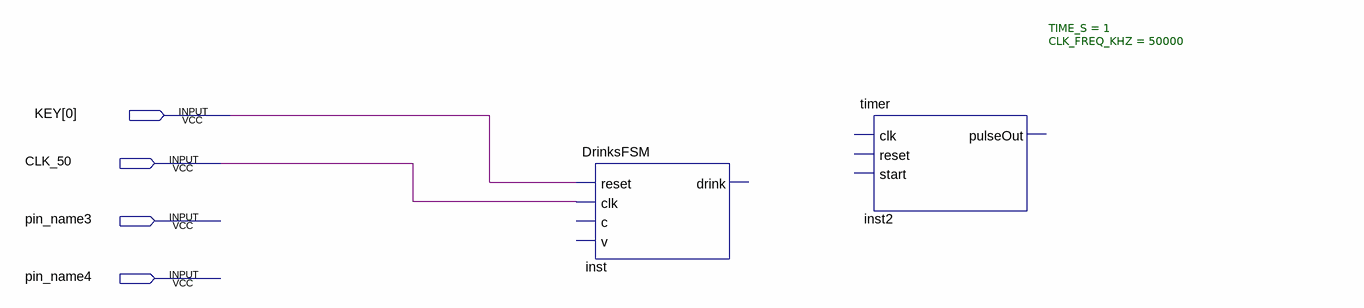
[diagram p0: schematic sheet]
// Quartus schematic Drinks.bdf as structural Verilog: 2 symbols, 4 pins
module Drinks (
  input  [0:0] KEY,
  input  CLK_50,
  input  pin_name3,
  input  pin_name4
);

  DrinksFSM inst (.reset(KEY[0]), .clk(CLK_50));  // open: c, v, drink
  timer #(.TIME_S(1), .CLK_FREQ_KHZ(50000)) inst2 ();  // open: clk, reset, start, pulseOut
endmodule
